# Altium schematic sheet Zapper.SchDoc
size A4
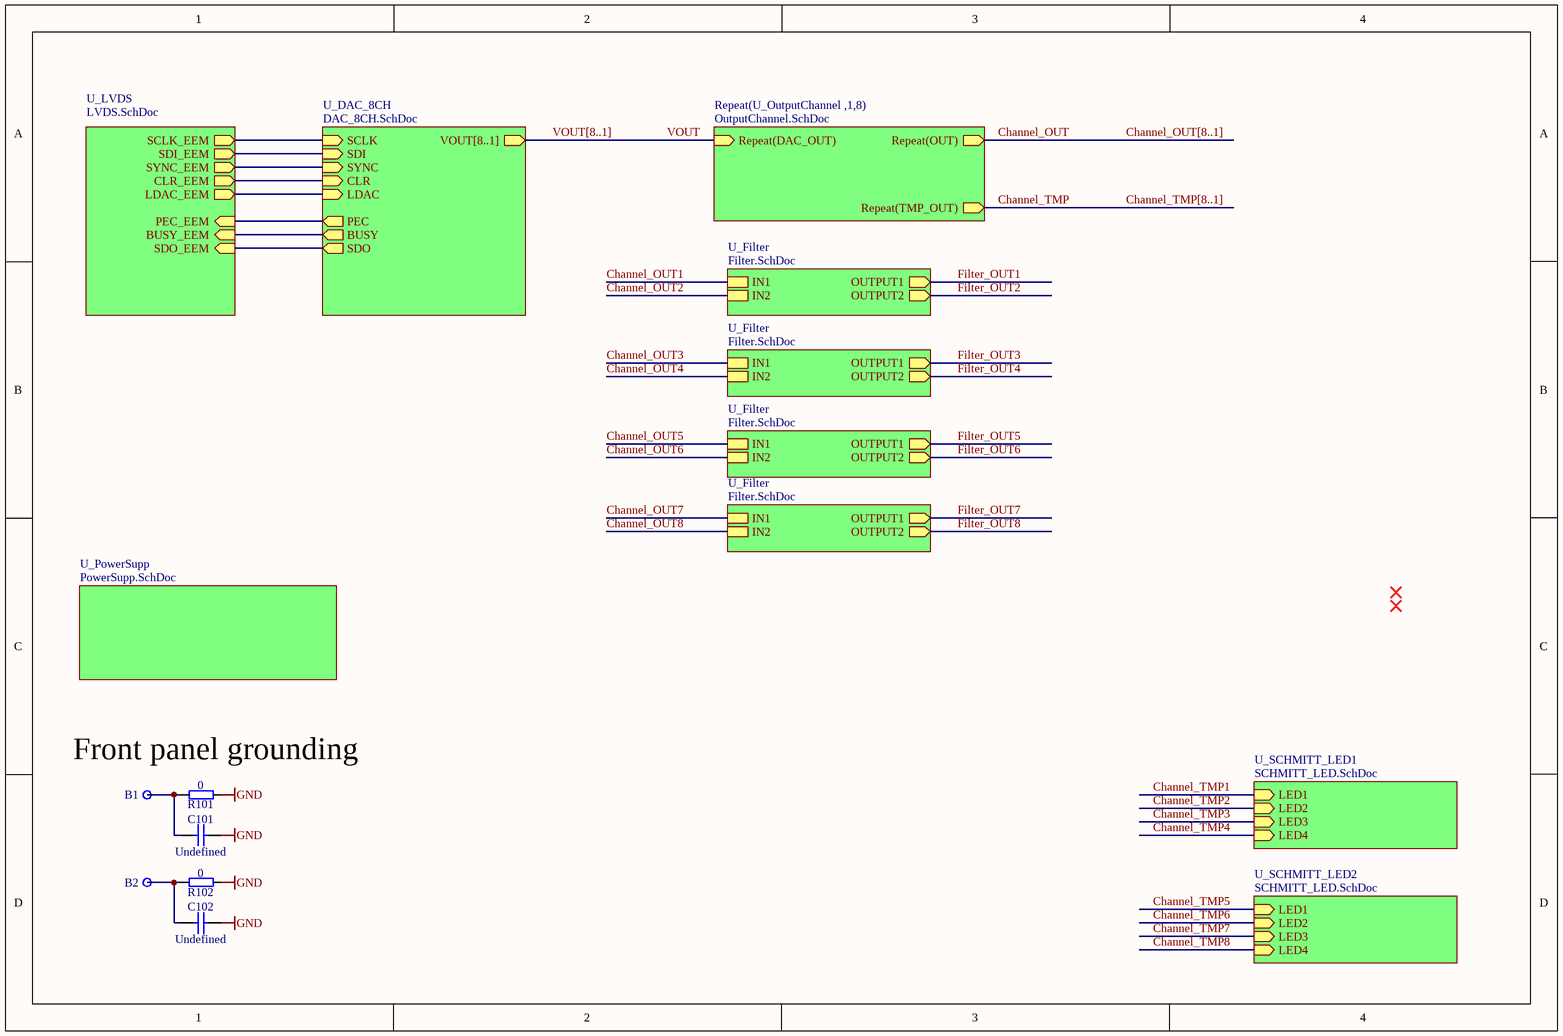
[diagram p0: Zapper.SchDoc]

## Parts
B1  Plated Hole  [MTG270_500]  (value not drawn)
B2  Plated Hole  [MTG270_500]  (value not drawn)
C101  Undefined  [CAPC2012X135N]
C102  Undefined  [CAPC2012X135N]
R101  0  [RESC1608X55N]
R102  0  [RESC1608X55N]

## Sub-sheets
Repeat(U_OutputChannel ,1,8) = OutputChannel.SchDoc: Repeat(OUT) (out), Repeat(DAC_OUT) (in), Repeat(TMP_OUT) (out)
U_DAC_8CH = DAC_8CH.SchDoc: SCLK (in), SDI (in), SYNC (in), BUSY (out), CLR (in), LDAC (in), PEC (out), SDO (out), VOUT[8..1] (out)
U_Filter = Filter.SchDoc: IN1, IN2, OUTPUT1 (out), OUTPUT2 (out)
U_Filter = Filter.SchDoc: IN1, IN2, OUTPUT1 (out), OUTPUT2 (out)
U_Filter = Filter.SchDoc: IN1, IN2, OUTPUT1 (out), OUTPUT2 (out)
U_Filter = Filter.SchDoc: IN1, IN2, OUTPUT1 (out), OUTPUT2 (out)
U_LVDS = LVDS.SchDoc: SCLK_EEM (out), SDO_EEM (in), SDI_EEM (out), SYNC_EEM (out), CLR_EEM (out), BUSY_EEM (in), LDAC_EEM (out), PEC_EEM (in)
U_PowerSupp = PowerSupp.SchDoc: no entries
U_SCHMITT_LED1 = SCHMITT_LED.SchDoc: LED1 (in), LED2 (in), LED3 (in), LED4 (in)
U_SCHMITT_LED2 = SCHMITT_LED.SchDoc: LED1 (in), LED2 (in), LED3 (in), LED4 (in)

## Nets
GND: C101.2 C102.2 R101.1 R102.1
Channel_OUT: sheet Repeat(U_OutputChannel ,1,8)/Repeat(OUT)
Channel_OUT1: sheet U_Filter/IN1
Channel_OUT2: sheet U_Filter/IN2
Channel_OUT3: sheet U_Filter/IN1
Channel_OUT4: sheet U_Filter/IN2
Channel_OUT5: sheet U_Filter/IN1
Channel_OUT6: sheet U_Filter/IN2
Channel_OUT7: sheet U_Filter/IN1
Channel_OUT8: sheet U_Filter/IN2
Channel_TMP: sheet Repeat(U_OutputChannel ,1,8)/Repeat(TMP_OUT)
Channel_TMP1: sheet U_SCHMITT_LED1/LED1
Channel_TMP2: sheet U_SCHMITT_LED1/LED2
Channel_TMP3: sheet U_SCHMITT_LED1/LED3
Channel_TMP4: sheet U_SCHMITT_LED1/LED4
Channel_TMP5: sheet U_SCHMITT_LED2/LED1
Channel_TMP6: sheet U_SCHMITT_LED2/LED2
Channel_TMP7: sheet U_SCHMITT_LED2/LED3
Channel_TMP8: sheet U_SCHMITT_LED2/LED4
Filter_OUT1: sheet U_Filter/OUTPUT1
Filter_OUT2: sheet U_Filter/OUTPUT2
Filter_OUT3: sheet U_Filter/OUTPUT1
Filter_OUT4: sheet U_Filter/OUTPUT2
Filter_OUT5: sheet U_Filter/OUTPUT1
Filter_OUT6: sheet U_Filter/OUTPUT2
Filter_OUT7: sheet U_Filter/OUTPUT1
Filter_OUT8: sheet U_Filter/OUTPUT2
VOUT: sheet Repeat(U_OutputChannel ,1,8)/Repeat(DAC_OUT)
NetB1_1: B1.1 C101.1 R101.2
NetB2_1: B2.1 C102.1 R102.2
(unnamed): sheet U_LVDS/SCLK_EEM, sheet U_DAC_8CH/SCLK
(unnamed): sheet U_LVDS/SDO_EEM, sheet U_DAC_8CH/SDO
(unnamed): sheet U_LVDS/SDI_EEM, sheet U_DAC_8CH/SDI
(unnamed): sheet U_LVDS/SYNC_EEM, sheet U_DAC_8CH/SYNC
(unnamed): sheet U_LVDS/CLR_EEM, sheet U_DAC_8CH/CLR
(unnamed): sheet U_LVDS/BUSY_EEM, sheet U_DAC_8CH/BUSY
(unnamed): sheet U_LVDS/LDAC_EEM, sheet U_DAC_8CH/LDAC
(unnamed): sheet U_LVDS/PEC_EEM, sheet U_DAC_8CH/PEC

## Buses and harness runs
bus Channel_OUT[8..1]
bus Channel_TMP[8..1]
bus VOUT[8..1] = sheet U_DAC_8CH/VOUT[8..1]

## Notes on the sheet
- Front panel grounding

## Library data of the parts
B1 B2 = PLATED_HOLE2.7_PAD5.0: Single Terminal Socket; Part Description: Plated Through Hole: Hole Dia.=2.7mm Pad Dia.=5.0mm; Mounted: No; Part Number: PLATED_HOLE2.7_PAD5.0; Component Kind: Standard (No BOM); Component Type: Standard (No BOM); Pin Count: 1; Family: Plated Hole; Socket: No; SMD: No; Sense: No; Status: None; ComponentHeight: 0mm; HelpURL: Undefined; Author: CERN DEM JMW; CreateDate: 27.09.2011; LatestRevisionDate: 27.09.2011; PackageDescription: Plated Through Hole: Hole Dia.=2.7mm Pad Dia.=5.0mm
C101 C102 = CC0805_NO-VALUE: Non-polarised capacitor; Part Description: Reserved Footprint For 0805(2012) Chip Ceramic Capacitor; Mounted: No; Part Number: CC0805_NO-VALUE; Component Kind: Standard; Component Type: Standard; Pin Count: 2; Value: Undefined; Status: None; Manufacturer: Undefined; Manufacturer Part Number: CC0805_NO-VALUE; Case: 0805; Socket: No; SMD: Yes; Sense: No; Manufacturer1 ComponentHeight: 1.35mm; HelpURL: Undefined; Author: CERN DEM JLC; CreateDate: 10.12.2008; LatestRevisionDate: 11.09.2013
R101 R102 = R0603_0R_JUMPER: Resistor; Part Description: 1A (0.05R Max DC Resistance) Zero Ohm Jumper; Manufacturer: GENERIC; Manufacturer1 Part Number: NRC06Z0; PressFit: No; Part Number: R0603_0R_JUMPER; Component Kind: Standard; Component Type: Standard; Pin Count: 2; Value: 0; Status: Preferred; Manufacturer Part Number: R0603_0R_JUMPER; Case: 0603; Mounted: Yes; Sense: No; Socket: No; SMD: Yes; Manufacturer1 Example: NIC COMPONENT; Manufacturer1 ComponentHeight: 0.55mm; HelpURL: \\cern.ch\dfs\Applications\Altium\Datasheets\R0603_NIC_NRC.pdf; Author: CERN DEM JLC; CreateDate: 03.12.2007; LatestRevisionDate: 13.03.2008